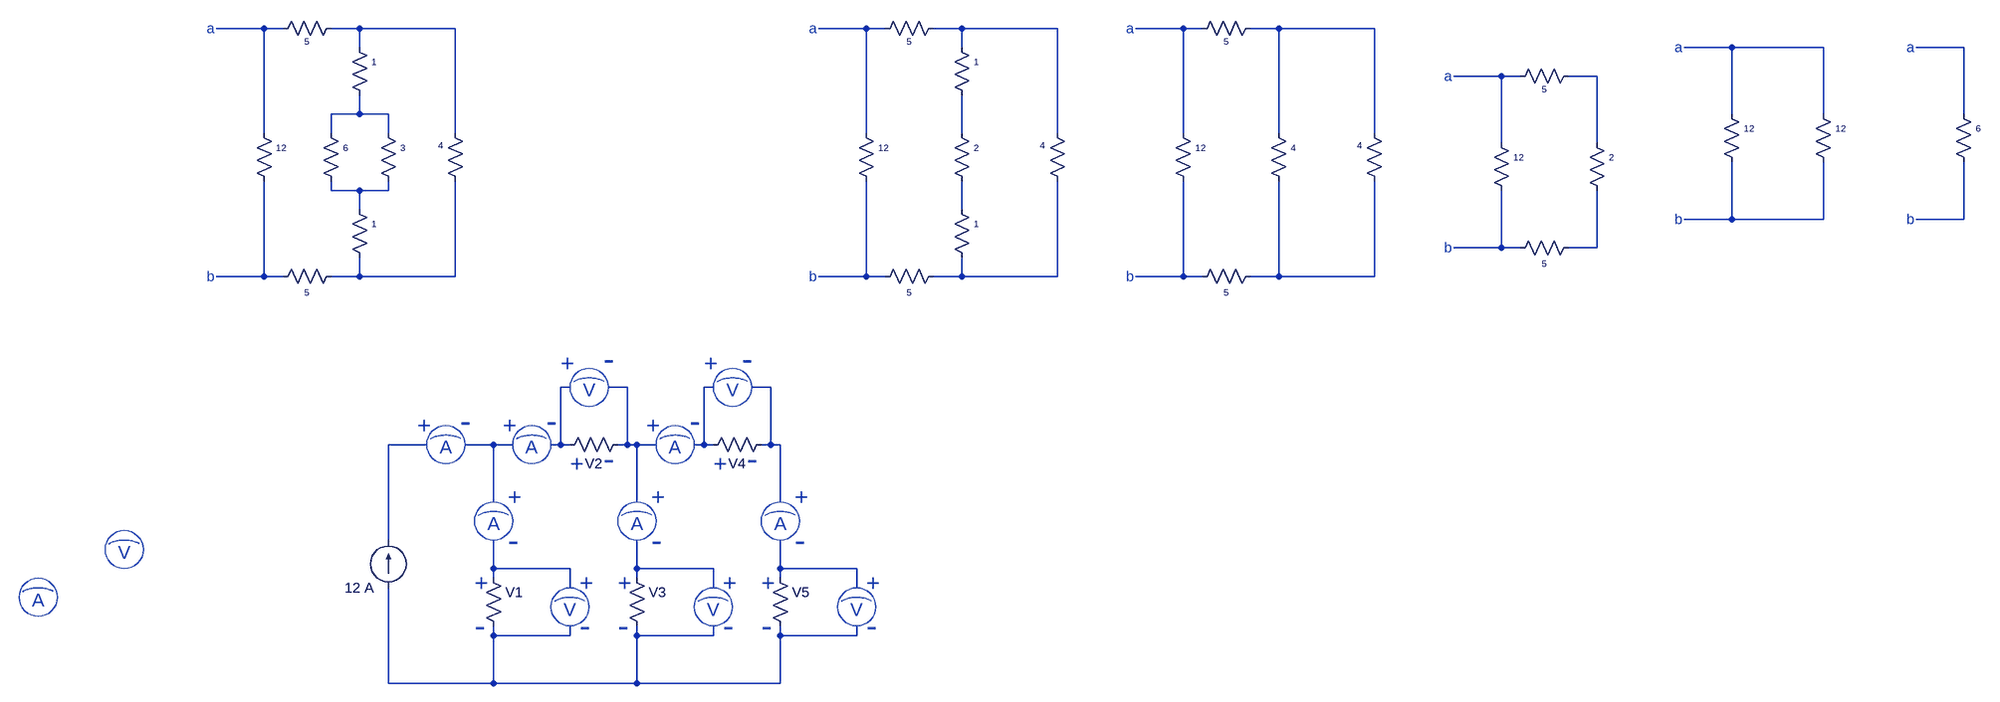
[diagram p0: schematic ELE112-1.asc]
ELE112-1.asc, the LTspice schematic file:
Version 4.1
SHEET 1 5388 2180
WIRE 112 -32 32 -32
WIRE 144 -32 112 -32
WIRE 272 -32 224 -32
WIRE 432 -32 272 -32
WIRE 1120 -32 1040 -32
WIRE 1152 -32 1120 -32
WIRE 1280 -32 1232 -32
WIRE 1440 -32 1280 -32
WIRE 2384 -32 2304 -32
WIRE 2416 -32 2384 -32
WIRE 2544 -32 2496 -32
WIRE 2704 -32 2544 -32
WIRE 272 0 272 -32
WIRE 1280 0 1280 -32
WIRE 4384 0 4304 0
WIRE 4544 0 4384 0
WIRE 5184 0 5104 0
WIRE 3360 48 3280 48
WIRE 3392 48 3360 48
WIRE 3520 48 3472 48
WIRE 272 112 272 80
WIRE 272 112 224 112
WIRE 320 112 272 112
WIRE 4384 112 4384 0
WIRE 4544 112 4544 0
WIRE 5184 112 5184 0
WIRE 112 144 112 -32
WIRE 224 144 224 112
WIRE 320 144 320 112
WIRE 432 144 432 -32
WIRE 1120 144 1120 -32
WIRE 1280 144 1280 80
WIRE 1440 144 1440 -32
WIRE 2384 144 2384 -32
WIRE 2544 144 2544 -32
WIRE 2704 144 2704 -32
WIRE 3360 160 3360 48
WIRE 3520 160 3520 48
WIRE 224 240 224 224
WIRE 272 240 224 240
WIRE 320 240 320 224
WIRE 320 240 272 240
WIRE 272 272 272 240
WIRE 1280 272 1280 224
WIRE 4384 288 4384 192
WIRE 4384 288 4304 288
WIRE 4544 288 4544 192
WIRE 4544 288 4384 288
WIRE 5184 288 5184 192
WIRE 5184 288 5104 288
WIRE 3360 336 3360 240
WIRE 3360 336 3280 336
WIRE 3392 336 3360 336
WIRE 3520 336 3520 240
WIRE 3520 336 3472 336
WIRE 112 384 112 224
WIRE 112 384 32 384
WIRE 144 384 112 384
WIRE 272 384 272 352
WIRE 272 384 224 384
WIRE 432 384 432 224
WIRE 432 384 272 384
WIRE 1120 384 1120 224
WIRE 1120 384 1040 384
WIRE 1152 384 1120 384
WIRE 1280 384 1280 352
WIRE 1280 384 1232 384
WIRE 1440 384 1440 224
WIRE 1440 384 1280 384
WIRE 2384 384 2384 224
WIRE 2384 384 2304 384
WIRE 2416 384 2384 384
WIRE 2544 384 2544 224
WIRE 2544 384 2496 384
WIRE 2704 384 2704 224
WIRE 2704 384 2544 384
WIRE 624 1312 608 1312
WIRE 720 1312 688 1312
WIRE 864 1312 848 1312
WIRE 960 1312 928 1312
WIRE 384 1408 320 1408
WIRE 496 1408 448 1408
WIRE 528 1408 496 1408
WIRE 608 1408 608 1312
WIRE 608 1408 592 1408
WIRE 624 1408 608 1408
WIRE 720 1408 720 1312
WIRE 720 1408 704 1408
WIRE 736 1408 720 1408
WIRE 768 1408 736 1408
WIRE 848 1408 848 1312
WIRE 848 1408 832 1408
WIRE 864 1408 848 1408
WIRE 960 1408 960 1312
WIRE 960 1408 944 1408
WIRE 976 1408 960 1408
WIRE 496 1504 496 1408
WIRE 736 1504 736 1408
WIRE 976 1504 976 1408
WIRE 320 1568 320 1408
WIRE 496 1616 496 1568
WIRE 624 1616 496 1616
WIRE 736 1616 736 1568
WIRE 864 1616 736 1616
WIRE 976 1616 976 1568
WIRE 1104 1616 976 1616
WIRE 496 1632 496 1616
WIRE 736 1632 736 1616
WIRE 976 1632 976 1616
WIRE 624 1648 624 1616
WIRE 864 1648 864 1616
WIRE 1104 1648 1104 1616
WIRE 496 1728 496 1712
WIRE 624 1728 624 1712
WIRE 624 1728 496 1728
WIRE 736 1728 736 1712
WIRE 864 1728 864 1712
WIRE 864 1728 736 1728
WIRE 976 1728 976 1712
WIRE 1104 1728 1104 1712
WIRE 1104 1728 976 1728
WIRE 320 1808 320 1648
WIRE 496 1808 496 1728
WIRE 496 1808 320 1808
WIRE 736 1808 736 1728
WIRE 736 1808 496 1808
WIRE 976 1808 976 1728
WIRE 976 1808 736 1808
SYMBOL res 304 128 R0
WINDOW 0 36 40 Left 1
WINDOW 3 36 76 Invisible 1
SYMATTR InstName 3
SYMBOL res 240 -48 R90
WINDOW 0 0 56 Invisible 2
WINDOW 3 38 56 VCenter 1
SYMATTR InstName 2
SYMATTR Value 5
SYMBOL res 448 240 R180
WINDOW 0 36 76 Left 1
WINDOW 3 36 40 Invisible 2
SYMATTR InstName 4
SYMATTR Value 1
SYMBOL res 128 400 R270
WINDOW 0 32 56 Invisible 2
WINDOW 3 0 56 VBottom 1
SYMATTR InstName R8
SYMATTR Value 5
SYMBOL res 208 128 R0
WINDOW 0 36 40 Left 1
WINDOW 3 36 76 Invisible 2
SYMATTR InstName 6
SYMBOL res 96 128 R0
WINDOW 0 36 40 Left 1
WINDOW 3 36 76 Invisible 2
SYMATTR InstName 12
SYMBOL res 256 -16 R0
WINDOW 0 36 40 Left 1
WINDOW 3 36 76 Invisible 2
SYMATTR InstName 1
SYMBOL res 256 256 R0
WINDOW 0 36 40 Left 1
WINDOW 3 36 76 Invisible 2
SYMATTR InstName 1
SYMBOL res 1248 -48 R90
WINDOW 0 0 56 Invisible 2
WINDOW 3 38 56 VCenter 1
SYMATTR InstName R2
SYMATTR Value 5
SYMBOL res 1456 240 R180
WINDOW 0 36 76 Left 1
WINDOW 3 36 40 Invisible 2
SYMATTR InstName 4
SYMATTR Value 1
SYMBOL res 1136 400 R270
WINDOW 0 32 56 Invisible 2
WINDOW 3 0 56 VBottom 1
SYMATTR InstName R4
SYMATTR Value 5
SYMBOL res 1264 128 R0
WINDOW 0 36 40 Left 1
WINDOW 3 36 76 Invisible 2
SYMATTR InstName 2
SYMBOL res 1104 128 R0
WINDOW 0 36 40 Left 1
WINDOW 3 36 76 Invisible 2
SYMATTR InstName 12
SYMBOL res 1264 -16 R0
WINDOW 0 36 40 Left 1
WINDOW 3 36 76 Invisible 2
SYMATTR InstName 1
SYMBOL res 1264 256 R0
WINDOW 0 36 40 Left 1
WINDOW 3 36 76 Invisible 2
SYMATTR InstName 1
SYMBOL res 2512 -48 R90
WINDOW 0 0 56 Invisible 2
WINDOW 3 38 56 VCenter 1
SYMATTR InstName R1
SYMATTR Value 5
SYMBOL res 2720 240 R180
WINDOW 0 36 76 Left 1
WINDOW 3 36 40 Invisible 2
SYMATTR InstName 4
SYMATTR Value 1
SYMBOL res 2400 400 R270
WINDOW 0 32 56 Invisible 2
WINDOW 3 0 56 VBottom 1
SYMATTR InstName R5
SYMATTR Value 5
SYMBOL res 2528 128 R0
WINDOW 0 36 40 Left 1
WINDOW 3 36 76 Invisible 2
SYMATTR InstName 4
SYMBOL res 2368 128 R0
WINDOW 0 36 40 Left 1
WINDOW 3 36 76 Invisible 2
SYMATTR InstName 12
SYMBOL res 3488 32 R90
WINDOW 0 0 56 Invisible 2
WINDOW 3 38 56 VCenter 1
SYMATTR InstName R3
SYMATTR Value 5
SYMBOL res 3376 352 R270
WINDOW 0 32 56 Invisible 2
WINDOW 3 0 56 VBottom 1
SYMATTR InstName R7
SYMATTR Value 5
SYMBOL res 3504 144 R0
WINDOW 0 36 40 Left 1
WINDOW 3 36 76 Invisible 2
SYMATTR InstName 2
SYMBOL res 3344 144 R0
WINDOW 0 36 40 Left 1
WINDOW 3 36 76 Invisible 2
SYMATTR InstName 12
SYMBOL res 4528 96 R0
WINDOW 0 36 40 Left 1
WINDOW 3 36 76 Invisible 2
SYMATTR InstName 12
SYMBOL res 4368 96 R0
WINDOW 0 36 40 Left 1
WINDOW 3 36 76 Invisible 2
SYMATTR InstName 12
SYMBOL res 5168 96 R0
WINDOW 0 36 40 Left 1
WINDOW 3 36 76 Invisible 2
SYMATTR InstName 6
SYMBOL res 480 1616 R0
WINDOW 3 36 76 Invisible 2
SYMATTR InstName V1
SYMBOL res 720 1616 R0
WINDOW 3 36 76 Invisible 2
SYMATTR Value ""
SYMATTR InstName V3
SYMBOL res 960 1616 R0
WINDOW 3 36 76 Invisible 2
SYMATTR InstName V5
SYMBOL res 720 1392 R90
WINDOW 0 0 56 Invisible 2
WINDOW 3 32 56 VTop 2
SYMATTR InstName R12
SYMATTR Value V2
SYMBOL res 960 1392 R90
WINDOW 0 0 56 Invisible 2
WINDOW 3 32 56 VTop 2
SYMATTR InstName V4
SYMATTR Value V4
SYMBOL current 320 1648 R180
WINDOW 0 24 80 Invisible 4
WINDOW 3 24 0 Left 2
WINDOW 123 0 0 Left 0
WINDOW 39 0 0 Left 0
SYMATTR InstName 12A
SYMATTR Value 12 A
TEXT 16 -32 Left 2 ;a
TEXT 16 384 Left 2 ;b
TEXT 1024 -32 Left 2 ;a
TEXT 1024 384 Left 2 ;b
TEXT 2288 -32 Left 2 ;a
TEXT 2288 384 Left 2 ;b
TEXT 3264 48 Left 2 ;a
TEXT 3264 336 Left 2 ;b
TEXT 4288 0 Left 2 ;a
TEXT 4288 288 Left 2 ;b
TEXT 5088 0 Left 2 ;a
TEXT 5088 288 Left 2 ;b
TEXT -368 1648 Top 3 ;A
TEXT -224 1568 Top 3 ;V
TEXT 560 1392 Top 3 ;A
TEXT 800 1392 Top 3 ;A
TEXT 496 1520 Top 3 ;A
TEXT 736 1520 Top 3 ;A
TEXT 976 1520 Top 3 ;A
TEXT 656 1296 Top 3 ;V
TEXT 896 1296 Top 3 ;V
TEXT 1104 1664 Top 3 ;V
TEXT 864 1664 Top 3 ;V
TEXT 624 1664 Top 3 ;V
TEXT 512 1376 Left 4 ;+
TEXT 752 1376 Left 4 ;+
TEXT 520 1496 Left 4 ;+
TEXT 760 1496 Left 4 ;+
TEXT 1000 1496 Left 4 ;+
TEXT 608 1272 Left 4 ;+
TEXT 848 1272 Left 4 ;+
TEXT 640 1640 Left 4 ;+
TEXT 880 1640 Left 4 ;+
TEXT 1120 1640 Left 4 ;+
TEXT 584 1368 Left 5 ;-
TEXT 680 1264 Left 5 ;-
TEXT 912 1264 Left 5 ;-
TEXT 824 1368 Left 5 ;-
TEXT 760 1568 Left 5 ;-
TEXT 1000 1568 Left 5 ;-
TEXT 520 1568 Left 5 ;-
TEXT 880 1712 Left 5 ;-
TEXT 1120 1712 Left 5 ;-
TEXT 640 1712 Left 5 ;-
TEXT 864 1440 Left 4 ;+
TEXT 920 1432 Left 5 ;-
TEXT 624 1440 Left 4 ;+
TEXT 680 1432 Left 5 ;-
TEXT 464 1640 Left 4 ;+
TEXT 464 1712 Left 5 ;-
TEXT 704 1640 Left 4 ;+
TEXT 704 1712 Left 5 ;-
TEXT 944 1640 Left 4 ;+
TEXT 944 1712 Left 5 ;-
TEXT 416 1392 Top 3 ;A
TEXT 368 1376 Left 4 ;+
TEXT 440 1368 Left 5 ;-
CIRCLE Normal -400 1696 -336 1632
CIRCLE Normal -256 1616 -192 1552
CIRCLE Normal 528 1440 592 1376
CIRCLE Normal 768 1440 832 1376
CIRCLE Normal 464 1568 528 1504
CIRCLE Normal 704 1568 768 1504
CIRCLE Normal 944 1568 1008 1504
CIRCLE Normal 624 1344 688 1280
CIRCLE Normal 864 1344 928 1280
CIRCLE Normal 1072 1712 1136 1648
CIRCLE Normal 832 1712 896 1648
CIRCLE Normal 592 1712 656 1648
CIRCLE Normal 384 1440 448 1376
ARC Normal -400 1680 -336 1648 -344 1654 -393 1655
ARC Normal -256 1600 -192 1568 -200 1574 -249 1575
ARC Normal 528 1424 592 1392 584 1398 535 1399
ARC Normal 768 1424 832 1392 824 1398 775 1399
ARC Normal 464 1552 528 1520 520 1526 471 1527
ARC Normal 704 1552 768 1520 760 1526 711 1527
ARC Normal 944 1552 1008 1520 1000 1526 951 1527
ARC Normal 624 1328 688 1296 680 1302 631 1303
ARC Normal 864 1328 928 1296 920 1302 871 1303
ARC Normal 1072 1696 1136 1664 1128 1670 1079 1671
ARC Normal 832 1696 896 1664 888 1670 839 1671
ARC Normal 592 1696 656 1664 648 1670 599 1671
ARC Normal 384 1424 448 1392 440 1398 391 1399

The netlist it stands for:
* ELE112-1.asc
R§3 N011 N013 R
R§2 N002 N001 5
R§4 N020 N002 1
R8 N019 N020 5
R§6 N011 N013 R
R§12 N001 N019 R
R§1 N002 N011 R
R§1 N013 N020 R
R2 N004 N003 5
R§4 N022 N004 1
R4 N021 N022 5
R§2 N012 N014 R
R§12 N003 N021 R
R§1 N004 N012 R
R§1 N014 N022 R
R1 N006 N005 5
R§4 N024 N006 1
R5 N023 N024 5
R§4 N006 N024 R
R§12 N005 N023 R
R3 N010 N009 5
R7 N017 N018 5
R§2 N010 N018 R
R§12 N009 N017 R
R§12 N007 N015 R
R§12 N007 N015 R
R§6 N008 N016 R
R§V1 N031 N034 R
R§V3 N032 N034
R§V5 N033 N034 R
R12 N026 N025 V2
R§V4 N028 N027 V4
I§12A N034 N029 12 A
* a
* b
* a
* b
* a
* b
* a
* b
* a
* b
* a
* b
* A
* V
* A
* A
* A
* A
* A
* V
* V
* V
* V
* V
* +
* +
* +
* +
* +
* +
* +
* +
* +
* +
* -
* -
* -
* -
* -
* -
* -
* -
* -
* -
* +
* -
* +
* -
* +
* -
* +
* -
* +
* -
* A
* +
* -
.backanno
.end